# EAGLE design ble121lr_dongle_v10 (EAGLE 7.7.0)
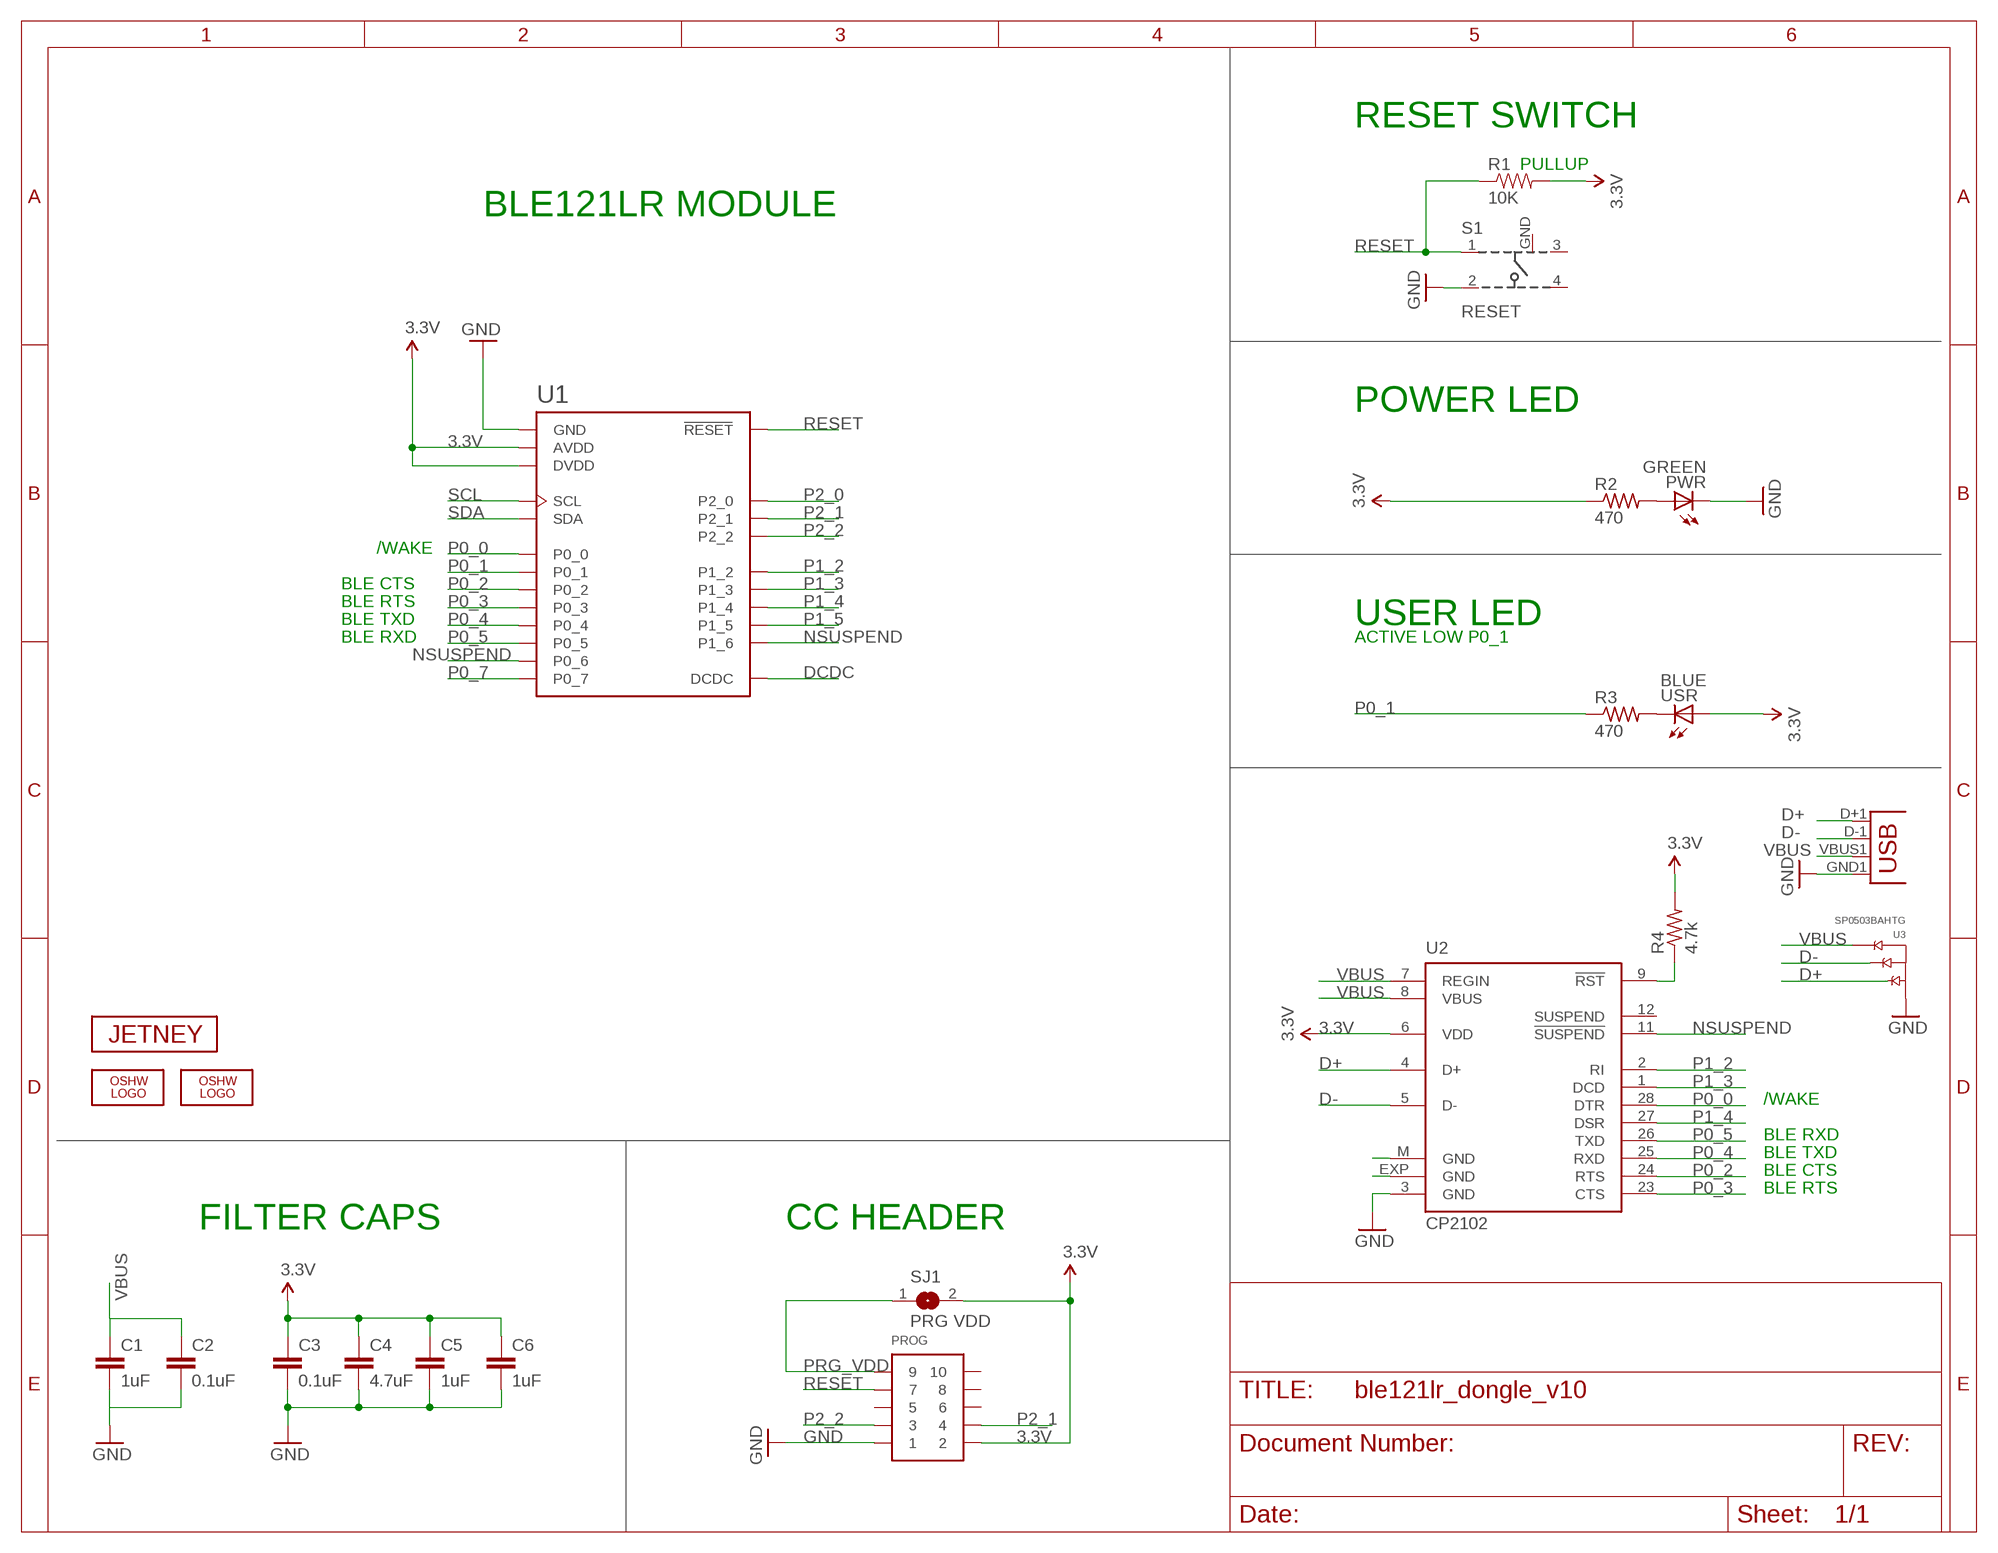
[diagram p0: schematic, sheet 1]

## Parts
C1  1uF  CAP0603-CAP  [0603-CAP]
C2  0.1uF  CAP0603-CAP  [0603-CAP]
C3  0.1uF  CAP0603-CAP  [0603-CAP]
C4  4.7uF  CAP0603-CAP  [0603-CAP]
C5  1uF  CAP0603-CAP  [0603-CAP]
C6  1uF  CAP0603-CAP  [0603-CAP]
JP1  USBA-SMD-MALE  [USB-A-SMT-MALE]
LOGO1  OSHW_LOGO_FILLX0100-NT  [OSHW_FILLX100_NOTEXT]
LOGO2  OSHW_LOGO_FILLX0070-NT  [OSHW_FILLX70_NOTEXT]
PROG  CONN_5-2-FTSH-V  [FTSH-105-DV]
PWR  GREEN  LEDCHIPLED_0805  [CHIPLED_0805]
R1  10K  RESISTOR0603-RES  [0603-RES]
R2  470  R-US_R0603  [R0603]
R3  470  R-US_R0603  [R0603]
R4  4.7k  R-US_R0603  [R0603]
S1  RESET  101-IG  [101-IG]
SJ1  PRG VDD  SJ  [SJ]
U1  BLE121LR-A  [BLE121LR-A]
U2  CP2102  [MLP28]
U3  SP0503BAHTG  [SOT143]
U$2  JETNEY-LOGO-12  [JETNEY-LOGO-12]
USR  BLUE  LEDCHIPLED_0805  [CHIPLED_0805]

## Nets
3.3V [power]: C3.1 C4.1 C5.1 C6.1 PROG.2 R1.2 R2.1 R4.2 SJ1.2 U1.AVDD U1.DVDD U2.6(VDD) USR.A
D+: JP1.D+1(D+) U2.4(D+) U3.2(A)
D-: JP1.D-1(D-) U2.5(D-) U3.3(B)
DCDC: U1.DCDC
GND [power]: C1.2 C2.2 C3.2 C4.2 C5.2 C6.2 JP1.GND1(GND) PROG.1 PWR.C S1.2 U1.GND U1.GND@2(GND) U1.GND@3(GND) U1.GND@4(GND) U1.GND@5(GND) U1.GND@6(GND) U1.GND@7(GND) U1.GND@8(GND) U1.GND@9(GND) U1.GND@10(GND) U1.GND@11(GND) U1.GND@12(GND) U1.GND@13(GND) U2.3(GND) U3.1(GND)
N$1: PWR.A R2.2
N$2 [power]: U2.M(GND)
N$4: R3.2 USR.C
N$5 [power]: U2.EXP(GND)
N$6: R4.1 U2.9(!RST)
NSUSPEND: U1.P0_6 U1.P1_6 U2.11(!SUSPEND)
P0_0: U1.P0_0 U2.28(DTR)
P0_1: R3.1 U1.P0_1
P0_2: U1.P0_2 U2.24(RTS)
P0_3: U1.P0_3 U2.23(CTS)
P0_4: U1.P0_4 U2.25(RXD)
P0_5: U1.P0_5 U2.26(TXD)
P0_7: U1.P0_7
P1_2: U1.P1_2 U2.2(RI)
P1_3: U1.P1_3 U2.1(DCD)
P1_4: U1.P1_4 U2.27(DSR)
P1_5: U1.P1_5
P2_0: U1.P2_0
P2_1: PROG.4 U1.P2_1
P2_2: PROG.3 U1.P2_2
PRG_VDD [power]: PROG.9 SJ1.1
RESET: PROG.7 R1.1 S1.1 U1.RESET
SCL: U1.SCL
SDA: U1.SDA
VBUS: C1.1 C2.1 JP1.VBUS1(VBUS) U2.7(REGIN) U2.8(VBUS) U3.4(C)
Unconnected: PROG.5 PROG.6 PROG.8 PROG.10 S1.3 S1.4 U2.12(SUSPEND)

## Notes on the sheet
- RESET SWITCH
- PULLUP
- BLE121LR MODULE
- POWER LED
- /WAKE
- BLE CTS
- BLE RTS
- BLE TXD | USER LED
- BLE RXD | ACTIVE LOW P0_1
- /WAKE
- BLE RXD
- BLE TXD
- BLE CTS
- BLE RTS
- FILTER CAPS | CC HEADER

## Power pins joined to a net without a drawn wire
GND: S1.GND

## Library data of the parts
C1-C6 = SparkFun:CAP: Capacitor Standard 0603 ceramic capacitor, and 0.1" leaded capacitor.
JP1 = SparkFun-Connectors:USB: USB Connectors USB-B-PTH is fully proven SKU : PRT-00139/CONN-08278 USB-miniB is fully proven SKU : PRT-00587 USB-A-PCB is untested. USB-A-H is throughly reviewed, but untested. Spark Fun Electronics SKU : PRT-00437 USB-B-SMT is throughly reviewed, but untested. Needs silkscreen touching up. USB-A-S has not been used/tested USB-MB-H has not been used/tested USB-MICROB has been used. CONN-09505
LOGO1 LOGO2 = oshw-logo:OSHW_LOGO_FILL
PROG = pel_misc:CONN_5-2
PWR USR = led:LED: LED OSRAM: - CHIPLED LG R971, LG N971, LY N971, LG Q971, LY Q971, LO R971, LY R971 LH N974, LH R974 LS Q976, LO Q976, LY Q976 LO Q996 - Hyper CHIPLED LW Q18S LB Q993, LB Q99A, LB R99A - SideLED LS A670, LO A670, LY A670, LG A670, LP A670 LB A673, LV A673, LT A673, LW A673 LH A674 LY A675 LS A676, LA A676, LO A676, LY A676, LW A676 LS A679, LY A679, LG A679 - Hyper Micro SIDELED® LS Y876, LA Y876, LO Y876, LY Y876 LT Y87S - SmartLED LW L88C, LW L88S LB L89C, LB L89S, LG L890 LS L89K, LO L89K, LY L89K LS L896, LA L896, LO L896, LY L896 - TOPLED LS T670, LO T670, LY T670, LG T670, LP T670 LSG T670, LSP T670, LSY T670, LOP T670, LYG T670 LG T671, LOG T671, LSG T671 LB T673, LV T673, LT T673, LW T673 LH T674 LS T676, LA T676, LO T676, LY T676, LB T676, LH T676, LSB T676, LW T676 LB T67C, LV T67C, LT T67C, LS T67K, LO T67K, LY T67K, LW E67C LS E67B, LA E67B, LO E67B, LY E67B, LB E67C, LV E67C, LT E67C LW T67C LS T679, LY T679, LG T679 LS T770, LO T770, LY T770, LG T770, LP T770 LB T773, LV T773, LT T773, LW T773 LH T774 LS E675, LA E675, LY E675, LS T675 LS T776, LA T776, LO T776, LY T776, LB T776 LHGB T686 LT T68C, LB T68C - Hyper Mini TOPLED® LB M676 - Mini TOPLED Santana® LG M470 LS M47K, LO M47K, LY M47K Source: http://www.osram.convergy.de LUXEON: - LUMILED® LXK2-PW12-R00, LXK2-PW12-S00, LXK2-PW14-U00, LXK2-PW14-V00 LXK2-PM12-R00, LXK2-PM12-S00, LXK2-PM14-U00 LXK2-PE12-Q00, LXK2-PE12-R00, LXK2-PE12-S00, LXK2-PE14-T00, LXK2-PE14-U00 LXK2-PB12-K00, LXK2-PB12-L00, LXK2-PB12-M00, LXK2-PB14-N00, LXK2-PB14-P00, LXK2-PB14-Q00 LXK2-PR12-L00, LXK2-PR12-M00, LXK2-PR14-Q00, LXK2-PR14-R00 LXK2-PD12-Q00, LXK2-PD12-R00, LXK2-PD12-S00 LXK2-PH12-R00, LXK2-PH12-S00 LXK2-PL12-P00, LXK2-PL12-Q00, LXK2-PL12-R00 Source: www.luxeon.com KINGBRIGHT: KA-3528ASYC Source: www.kingbright.com
R1 = SparkFun:RESISTOR: Resistor Basic schematic elements and footprints for 0603, 1206, and PTH resistors.
R2-R4 = resistor:R-US_: RESISTOR, American symbol
S1 = sf-keyglove:101-IG
SJ1 = jumper:SJ: SMD solder JUMPER
U1 = sf-bluegiga:BLE121LR: Bluetooth Low Energy single-mode long-range module - Bluetooth 4.0 (CC2541). BLE121LR-A variant has an on-module ceramic chip antenna. BLE121LR-A variant includes keepout/restrict area. Antenna edge of the module should be flush up against the edge of the PCB. See datasheet for variant layout details. IT IS EXTREMELY IMPORTANT THAT YOU FOLLOW THE LAYOUT GUIDELINES FOR THIS MODULE IN ORDER TO ENSURE MAXIMUM RANGE. THIS MEANS THAT YOU NEED A SOLID GROUND PLANE EXTENDING AT LEAST 17 mm ON THE LEFT AND RIGHT SIDES OF THE MODULE, AS SHOWN IN THE DATASHEET. BLE121LR is a Bluetooth Smart Long Range module targeted for Bluetooth Smart applications where the best possible RF performance and range are required. At +8 dBm TX power and -98 dBm sensitivity BLE121LR has best-in-class RF performance and can provide Bluetooth Smart connectivity up to 450 meters. BLE121LR integrates all features required for a Bluetooth Smart application: Bluetooth radio, software stack and GATT based profiles. and it can also host end user applications, which means no external micro controller is required in size, price or power constrained devices. BLE121LR Bluetooth Smart module also has flexible hardware interfaces to connect to different peripherals or sensors. Although BLE121LR Bluetooth Smart Long Range Module is target for applications requiring high RF performance, it is still has relatively low power consumption and can be power using a standard 3V coin cell batteries. https://www.bluegiga.com/en-US/products/bluetooth-4.0-modules/ble121lr-bluetooth--smart-long https://github.com/jrowberg/sf-oshw Last updated 2014-08-02 by Jeff Rowberg <jeff@rowberg.net>; ANTENNA: On-module ceramic chip antenna
U2 = silabs:CP210*: Single-Chip USB to UART Bridge Source: www.silabs.com .. CP2101.pdf / cp2102.pdf; MF: FARNELL; MPN: CP2102-GM; OC_FARNELL: 9282130; OC_NEWARK: 30K5635
U3 = littlefuse:SP0503BAHTG
U$2 = sf-keyglove:JETNEY-LOGO

## Net classes
0 default: width 0.152 mm, drill 0.33 mm, clearance 0.152 mm
1 power: width 0.254 mm, drill 0.33 mm, clearance 0.152 mm

## Board
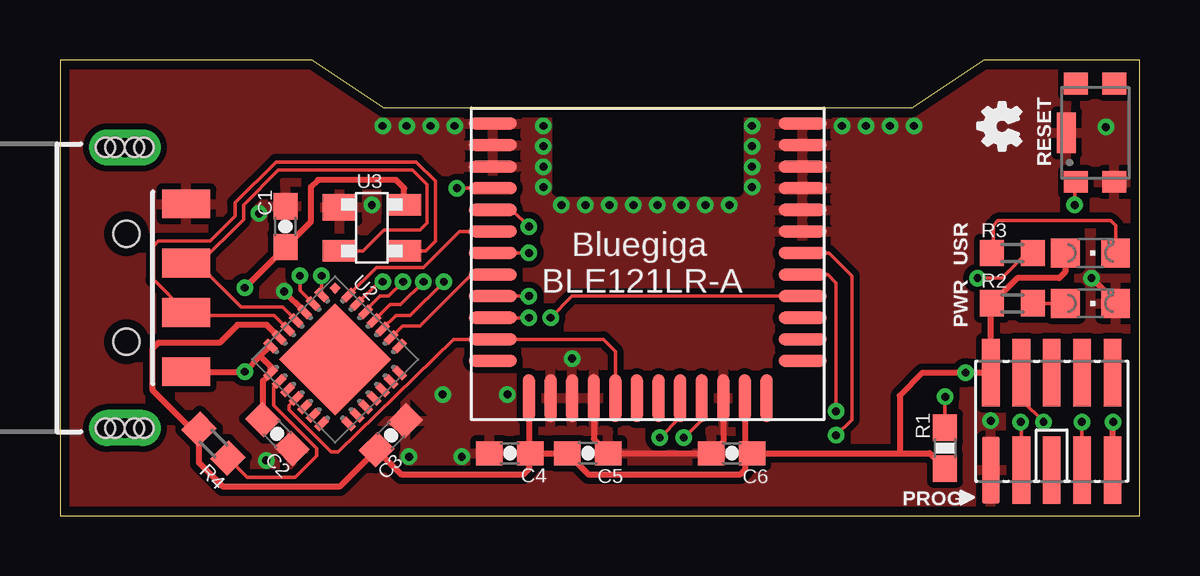
[diagram p1: board, top side]
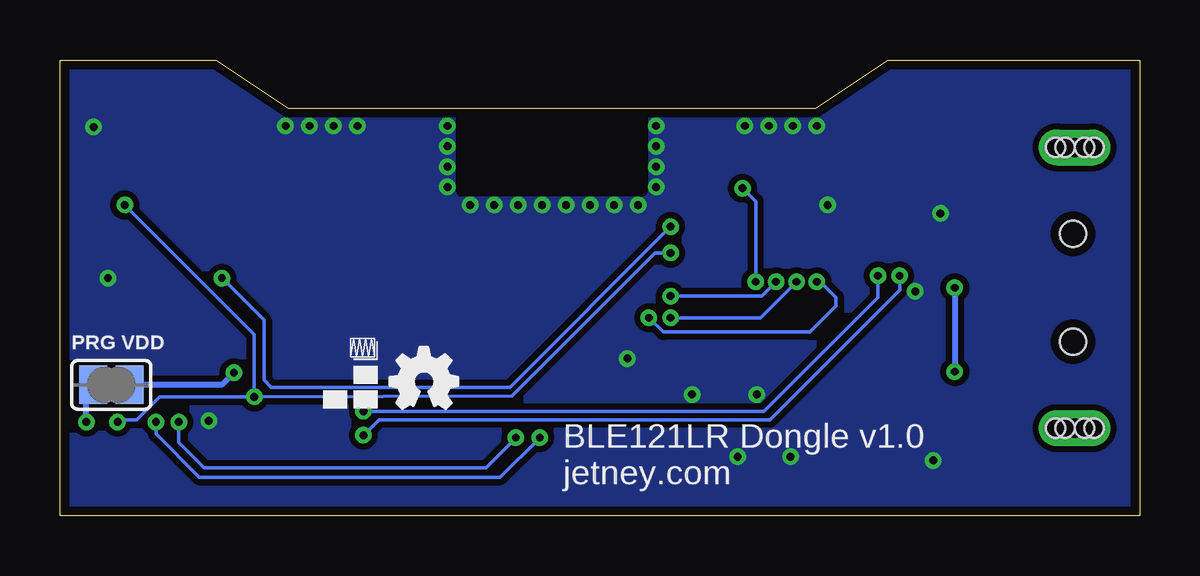
[diagram p2: board, bottom side, seen from below]

Size 45 x 19 mm. Coordinates in mm from the lower left corner, seen from the top.
Outline: 0,0 45,0 45,19 38.5,19 35.5,17 13.5,17 10.5,19 0,19 0,0
Copper layers (1*16): Top 0.0356mm / dielectric 1.5011mm / Bottom 0.0356mm
Design rules "default": minimum track width 6mil, minimum drill 13mil, track to track 6mil, track to pad 6mil, pad to pad 6mil, via to via 6mil, smd to smd 6mil, copper to edge 15mil, drill to drill 6mil, minimum pad ring 7mil, minimum via ring 7mil, stop-mask expansion 4mil, vias tented up to drill 13mil, thermal gap 10mil

### Footprints (pad centres in the part's own frame; a part is rotated, then mirrored left to right if it is on the bottom)
0603-CAP = smd 1.1 x 1: 1 -0.85,0; 2 0.85,0
USB-A-SMT-MALE = smd 1.2 x 2: D+1 1.027,-3.67; D-1 -1.027,-3.67; GND1 3.5,-3.67; VBUS1 -3.5,-3.67 | drill 0.8 pad 1.5 long: P$1 5.85,-1.1; P$3 -5.85,-1.1 | hole 1.1: 2.25,-1.17; -2.25,-1.17 | hole 0.8: -5.85,-1.5; -5.85,-1.9; -5.85,-0.7; -5.85,-0.3; 5.85,-1.5; 5.85,-1.9; 5.85,-0.7; 5.85,-0.3
FTSH-105-DV = smd 0.74 x 2.8: 1 -2.54,-2.03; 2 -2.54,2.03; 3 -1.27,-2.03; 4 -1.27,2.03; 5 0,-2.03; 6 0,2.03; 7 1.27,-2.03; 8 1.27,2.03; 9 2.54,-2.03; 10 2.54,2.03
CHIPLED_0805 = smd 1.2 x 1.2: A 0,-1.05; C 0,1.05
0603-RES = smd 1.1 x 1: 1 -0.85,0; 2 0.85,0
R0603 = smd 1 x 1.1: 1 -0.85,0; 2 0.85,0
101-IG = smd 0.9 x 1: 1 -2.05,0.8; 2 -2.05,-0.8; 3 2.05,0.8; 4 2.05,-0.8 | smd 1.7 x 0.8: GND 0,1.2
SJ = smd 1.168 x 1.6: 1 -0.762,0; 2 0.762,0
BLE121LR-A = smd 0.5 x 2: AVDD -4.95,-5.6; DCDC -0.45,-5.6; DVDD 4.05,-5.6; GND@4 -4.05,-5.6; GND@5 -3.15,-5.6; GND@6 -2.25,-5.6; GND@7 3.15,-5.6; P1_6 -1.35,-5.6; P2_0 0.45,-5.6; P2_1 1.35,-5.6; P2_2 2.25,-5.6; SCL 4.95,-5.6 | smd 2 x 0.5: GND -6.45,5.85; GND@2 -6.45,4.95; GND@3 -6.45,4.05; GND@8 6.45,1.35; GND@9 6.45,2.25; GND@10 6.45,3.15; GND@11 6.45,4.05; GND@12 6.45,4.95; GND@13 6.45,5.85; NC 6.45,-3.15; P0_0 -6.45,1.35; P0_1 -6.45,2.25; P0_2 -6.45,3.15; P0_3 -6.45,-0.45; P0_4 -6.45,-1.35; P0_5 -6.45,-2.25; P0_6 -6.45,-3.15; P0_7 -6.45,-4.05; P1_2 6.45,0.45; P1_3 6.45,-0.45; P1_4 6.45,-1.35; P1_5 6.45,-2.25; RESET -6.45,0.45; SDA 6.45,-4.05
MLP28 = smd 0.6 x 0.3: 1 -2.3,1.5; 2 -2.3,1; 3 -2.3,0.5; 4 -2.3,0; 5 -2.3,-0.5; 6 -2.3,-1; 7 -2.3,-1.5; 15 2.3,-1.5; 16 2.3,-1; 17 2.3,-0.5; 18 2.3,0; 19 2.3,0.5; 20 2.3,1; 21 2.3,1.5 | smd 0.3 x 0.6: 8 -1.5,-2.3; 9 -1,-2.3; 10 -0.5,-2.3; 11 0,-2.3; 12 0.5,-2.3; 13 1,-2.3; 14 1.5,-2.3; 22 1.5,2.3; 23 1,2.3; 24 0.5,2.3; 25 0,2.3; 26 -0.5,2.3; 27 -1,2.3; 28 -1.5,2.3 | smd 3.3 x 3.3: EXP 0,0 | smd 0.335 x 0.335: M -2.103,2.103
SOT143 = smd 1.4 x 1.1: 1 -1.35,0.86 | smd 1.4 x 0.9: 2 -1.35,-0.96; 3 1.35,-0.96; 4 1.35,0.96

### Placement (x,y rotation side)
C1  9.4,12.05 90 top
C2  9.06,3.4 315 top
C3  13.8,3.35 45 top
C4  18.75,2.6 180 top
C5  22,2.6 0 top
C6  28,2.6 180 top
JP1  1.6,9.5 90 top
LOGO1  31.24,4.46 0 bottom
LOGO2  40.04,15.24 90 top
PROG  41.34,3.93 0 top
PWR  42.95,8.85 270 top
R1  36.89,2.81 270 top
R2  39.7,8.85 0 top
R3  39.7,10.95 180 top
R4  6.4,3 135 top
S1  43.15,15.96 90 top
SJ1  42.86,5.45 0 bottom
U1  24.5,10.5 0 top
U2  11.47,6.51 315 top
U3  13,12 0 top
U$2  34.04,4.46 0 bottom
USR  42.95,10.95 270 top

### Tracks (layer width: path | path; a pad name or v marks a point on that pad's centre or on a via)
3.3V  (via drill 0.33)
  Top 0.254: U1.DVDD 28.55,2.9 | 28.55,2.9 C6.1 35,2.6 | 35,2.6 36.25,2.6 R1.2 | 35,2.6 35,5 35.96,5.96 v37.75,5.96 PROG.2 38.8,8.8 R2.1 39.9,9.9 41.65,9.9 41.9,10.15 USR.A | U2.6 8.62,7.95 7.4,7.95 6.65,7.2 4.1,7.2 3.85,6.95 3.85,5.25 5.5,3.6 R4.2 5.8,2.2 6.8,1.2 11.65,1.2 C3.1 14.25,1.7 19.3,1.7 19.55,1.95 19.55,2.65 | U1.AVDD 19.55,2.65 | 19.55,2.65 C4.1 C5.1 22.05,1.7 28.35,1.7 28.55,1.9 28.55,2.9
  Bottom 0.254: v37.75,5.96 38.26,5.45 SJ1.2
D+
  Top 0.152: U2.4 9.28,8.7 7.55,8.7 5.72,10.53 | U3.2 12.64,11.04 13.5,11.9 15,11.9 15.3,12.2 15.3,13.8 14.7,14.4 9.1,14.4 7.65,12.95 7.65,12.35 5.83,10.53 5.72,10.53 | 5.72,10.53 JP1.D+1
D-
  Top 0.152: U3.3 15.24,11.04 15.65,11.45 15.65,13.95 14.85,14.75 9,14.75 7.3,13.05 7.3,12.5 6.25,11.45 4.1,11.45 3.9,11.25 3.9,9.84 JP1.D-1 5.39,8.35 8.92,8.35 U2.5
GND  (via drill 0.33)
  Top 0.254: PWR.C 44,8.9 v43,9.9 | U1.GND@6 22.25,3.2 C5.2 C6.2 27.65,3.1 U1.GND@7 | U2.3 10.2,8.5 v9.35,9.35
  other vias: 32.6,16.25 38.8,3.95 8.6,2.3 16.75,2.45 21.35,6.55 43.6,16.2 18.65,5.05 15.95,5.05 14.55,2.45 8.3,12.6 13,12.95 33.6,16.25 34.6,16.25 35.6,16.25 16.45,16.25 28.85,16.25 28.85,15.4 28.85,14.55 28.85,13.7 27.9,12.95 26.9,12.95 25.9,12.95 24.9,12.95 23.9,12.95 22.9,12.95 21.9,12.95 20.9,12.95 20.15,13.7 20.15,14.55 20.15,15.4 20.15,16.25 15.45,16.25 14.45,16.25 13.45,16.25
  pour Bottom (isolate 0.254): 0,0 45,0 45,19 0,19
  pour Top (isolate 0.254): 0,0 45,0 45,19 0,19
N$1
  Top 0.152: R2.2 PWR.A
N$4
  Top 0.152: USR.C 44,12.1 43.8,12.3 39.1,12.3 38.9,12.1 38.9,11 R3.2
N$6
  Top 0.152: U2.9 8.9,5.35 8.9,4.6 10.7,2.8 10.7,2.5 9.8,1.6 7.8,1.6 R4.1 | R4.1
NSUSPEND
  Top 0.152: U2.11 9.55,4.6 9.55,4.4 11.3,2.65 11.6,2.65 16.4,7.35 U1.P0_6 22.65,7.35 23.15,6.85 U1.P1_6
  Top 0.254: U2.11
P0_0
  Top 0.152: U2.28 13.19,10.35 15.15,10.35 16.65,11.85 U1.P0_0
P0_1  (via drill 0.33)
  Top 0.152: R3.1 40.5,10.9 40.25,10.9 39.25,9.9 v38.25,9.9 | v19.55,12.05 18.85,12.75 U1.P0_1
  Bottom 0.152: v38.25,9.9 36.5,8.15 36.5,5.65 36.2,5.35 26.25,5.35 v19.55,12.05
P0_2  (via drill 0.33)
  Top 0.152: U2.24 13.45,7.8 14,8.35 14.6,8.35 v16,9.75 | v16.55,13.65 U1.P0_2
  Bottom 0.152: v16,9.75 16,13.1 v16.55,13.65
P0_3
  Top 0.152: U2.23 14.27,7.9 15,7.9 17.15,10.05 U1.P0_3
P0_4  (via drill 0.33)
  Top 0.152: U2.25 13.76,8.8 14.2,8.8 v15.15,9.75 | v19.55,9.15 U1.P0_4
  Bottom 0.152: v15.15,9.75 15.75,9.15 v19.55,9.15
P0_5  (via drill 0.33)
  Top 0.152: U2.26 12.74,8.54 13.35,9.15 13.7,9.15 v14.3,9.75 | v19.55,8.25 18.15,8.25 18.1,8.3 U1.P0_5
  Bottom 0.152: v14.3,9.75 15.8,8.25 v19.55,8.25
P1_2  (via drill 0.33)
  Top 0.152: U2.2 10,9.39 v10,10 | v32.35,3.35 33,4 33,10 32.05,10.95 U1.P1_2
  Bottom 0.152: v10,10 10,9.4 15.4,4 31.7,4 v32.35,3.35
P1_3  (via drill 0.33)
  Top 0.152: U2.1 10.9,9.95 v10.9,10 | v32.35,4.35 32.35,9.7 32,10.05 U1.P1_3
  Bottom 0.152: v10.9,10 10.9,9.1 15.65,4.35 v32.35,4.35
P1_4  (via drill 0.33)
  Top 0.152: U2.27 13.3,9.75 v13.45,9.75 | v20.45,8.25 21.35,9.15 U1.P1_4
  Bottom 0.152: v13.45,9.75 13.3,9.75 12.65,9.1 12.65,8.75 13.75,7.65 19.85,7.65 v20.45,8.25
P2_1  (via drill 0.33)
  Top 0.152: PROG.4 40.07,4.93 40.1,4.93 40.1,4.8 v41,3.9 | v25,3.25 25.85,4.1 U1.P2_1
  Bottom 0.152: v41,3.9 41,3.4 39.2,1.6 26.65,1.6 v25,3.25
P2_2  (via drill 0.33)
  Top 0.152: PROG.3 40.07,3.88 v40.05,3.9 | v26,3.25 26.75,4 U1.P2_2
  Bottom 0.152: v40.05,3.9 40.05,3.05 39,2 27.25,2 v26,3.25
PRG_VDD  (via drill 0.33)
  Top 0.254: PROG.9 43.88,3.88 v43.9,3.9
  Bottom 0.254: v43.9,3.9 43.9,5.18 SJ1.1
RESET  (via drill 0.33)
  Top 0.152: PROG.7 v42.6,3.9 | v36.9,4.95 v36.89,4.94 R1.1 | v19.55,10.95 U1.RESET | S1.1 42.3,13.86 v42.3,12.95
  Bottom 0.152: v42.6,3.9 42.5,4 41.8,4 40.85,4.95 v36.9,4.95 | v36.9,4.95 26.15,5 20.2,10.95 v19.55,10.95 | v42.3,12.95 36.9,7.55 v36.9,4.95
VBUS  (via drill 0.33)
  Top 0.254: JP1.VBUS1 v7.7,6 v7.71,6 8.35,6.65 | 8.35,6.65 U2.7 | 8.35,6.65 8.78,6.22 U2.8 8.46,5.62 C2.1 | U3.4 14.35,13.65 14,14 10.75,14 10.45,13.7 10.45,12.25 C1.1 v7.7,9.5
  Bottom 0.254: v7.7,9.5 v7.7,6

### Text on the board
tPlace: RESET | Bluegiga | BLE121LR-A
bPlace: PRG VDD | BLE121LR Dongle v1.0 | jetney.com